# Altium project DCDC_5V.PrjPcb
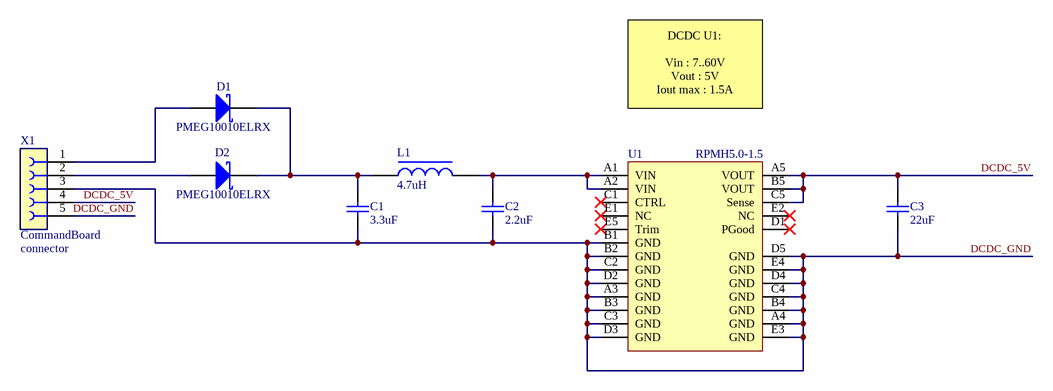
[diagram p0: DCDC_5V.SchDoc]
ProjectAuthor: PZO; ProjectiAiTitle: iAi_TemplateProject; ProjectNumber: N° SGX; ProjectVersion: 1.0.0; ProjectVersionForDoc: 1_0_0
1 sheet, 8 parts. Net scope: global (net labels, ports and power ports of the same name join across sheets).
Board file: DCDC_5V.PcbDoc

## Sheet DCDC_5V.SchDoc: DCDC 10..48V to 5V
size A4; Author: PZO; Organization: Institut d'Automatisation Industrielle; SheetNumber: 1; SheetTotal: 1; SVN: OUI; Version: 1.0.0; NoProject: N° SGX; ProjectTitle: iAi_TemplateProject; CurrentTime: 6; CurrentDate: 5; DocumentFullPathAndName: 8; DocumentName: 9; ModifiedDate: 13; ProjectName: <projet>

### Parts
C1  value 3.3uF  [CAPC3216X19N]  (hidden comment: CAP CER 3.3uF 1206)
C2  value 2.2uF  [CAPC3216X19N]  (hidden comment: CAP CER 2.2uF 1206)
C3  value 22uF  [CAPC1608X08N]  (hidden comment: CAP CER 22uF 0603)
D1  value PMEG10010ELRX  [DIOM2617X11N]  (hidden comment: DIODE SCHOTTKY 100V 1A SOD123)
D2  value PMEG10010ELRX  [DIOM2617X11N]  (hidden comment: DIODE SCHOTTKY 100V 1A SOD123)
L1  value 4.7uH  [INDC2520X12N]  (hidden comment: IND SMD 2020)
U1  value RPMH5.0-1.5  [CONV_RPMH5.0-1.5]  (hidden comment: DCDC 5V 1.5A)
X1  Use: CommandBoard  system: connector  [62000611821 - 5pin]  (hidden comment: CONNECT HEADER 5pos 180°)

### Nets
DCDC_5V: C3.2 U1.A5(VOUT) U1.B5(VOUT) U1.C5(Sense) X1.4
DCDC_GND: C1.1 C2.1 C3.1 U1.A3(GND) U1.A4(GND) U1.B1(GND) U1.B2(GND) U1.B3(GND) U1.B4(GND) U1.C2(GND) U1.C3(GND) U1.C4(GND) U1.D2(GND) U1.D3(GND) U1.D4(GND) U1.D5(GND) U1.E3(GND) U1.E4(GND) X1.3 X1.5
NetC1_2: C1.2 D1.1(K) D2.1(K) L1.1
NetC2_2: C2.2 L1.2 U1.A1(VIN) U1.A2(VIN)
NetD1_2: D1.2(A) X1.1
NetD2_2: D2.2(A) X1.2

Not connected (* = marked no-connect by the designer): U1 C1(CTRL)* D1(PGood)* E1(NC)* E2(NC)* E5(Trim)*

### Notes on the sheet
- DCDC U1:
  Vin : 7..60V
  Vout : 5V
  Iout max : 1.5A
- Title
- Institut d'automatisation industrielle
  rte de Cheseaux 1
  CH-1401 Yverdon-les-Bains
  T +41(0)24 55 77 377    F +41(0)24 55 76 320
  http://iai.heig-vd.ch       iai@heig-vd.ch
- Date:
- Size:
- A4
- Project:
- Sheet
- of
- No.
- Author:
- SVN
- Version
- File:

### Library data of the parts
C1 = CAP CER 3.3uF 10% 100V 1206: 3,3µF ±10% 100V Condensateurs céramique X7S 1206 (3216 métrique); Supplier 1: Digi-Key; Supplier Part Number 1: 445-15583-1-ND
C2 = CAP CER 2.2uF 10% 75V 1206: 2,2µF ±10% 75V Condensateurs céramique X7R 1206 (3216 métrique); Supplier 1: Digi-Key; Supplier Part Number 1: 445-181654-1-ND
C3 = CAP CER 22uF 200% 6V3 0603: 22µF ±20% 6,3V Condensateurs céramique X5R 0603 (1608 métrique)
D1 D2 = DIODE SCHOTTKY 100V 1A SOD123: Diode Schottky 100V 1A Montage en surface CFP3; Supplier 1: Digi-Key; Supplier Part Number 1: 1727-2394-1-ND
L1 = IND SMD 4.7uH: 4,7µH Blindé Inducteur 1,5A 190mOhms maxi 1008 (2520 métrique); Supplier 1: Digi-Key; Supplier Part Number 1: 490-13051-1-ND
U1 = RPMH5.0-1.5
X1 = CONNECT HEADER 5pos 180° 2mm: Value: *